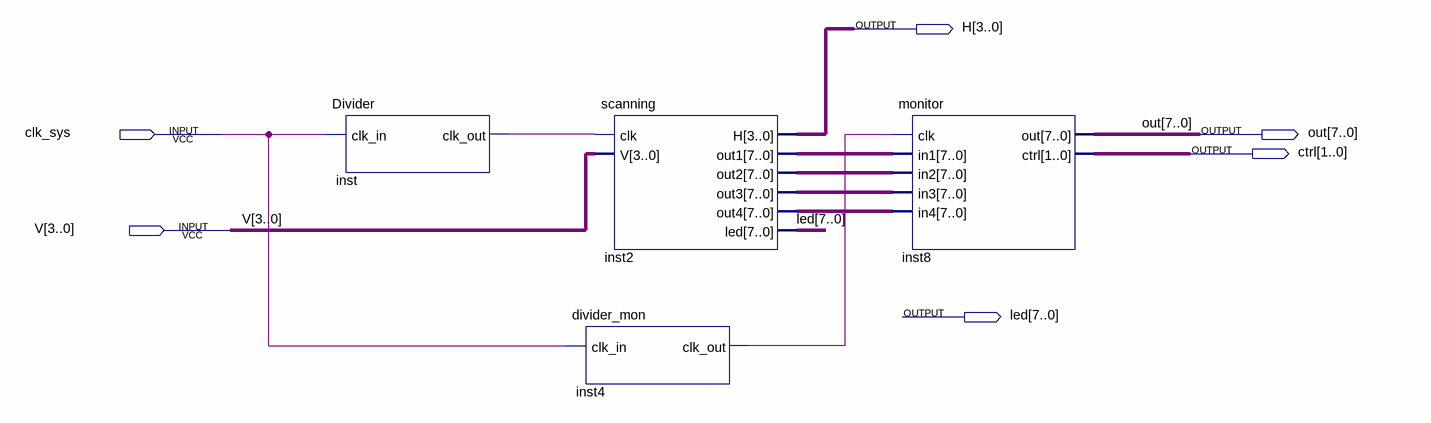
[diagram p0: schematic sheet]
// Quartus schematic keyboard1.bdf as structural Verilog: 4 symbols, 6 pins
module keyboard1 (
  input  clk_sys,
  input  [3:0] V,
  output [3:0] H,
  output [7:0] out,
  output [1:0] ctrl,
  output [7:0] led
);

  wire inst4_clk_out, inst_clk_out;
  wire [7:0] inst2_out1, inst2_out2, inst2_out3, inst2_out4;

  Divider inst (.clk_in(clk_sys), .clk_out(inst_clk_out));
  scanning inst2 (
    .clk(inst_clk_out), .V(V), .H(H), .out1(inst2_out1), .out2(inst2_out2), .out3(inst2_out3),
    .out4(inst2_out4), .led(led));
  divider_mon inst4 (.clk_in(clk_sys), .clk_out(inst4_clk_out));
  monitor inst8 (
    .clk(inst4_clk_out), .in1(inst2_out1), .in2(inst2_out2), .in3(inst2_out3), .in4(inst2_out4), .out(out),
    .ctrl(ctrl));
endmodule
